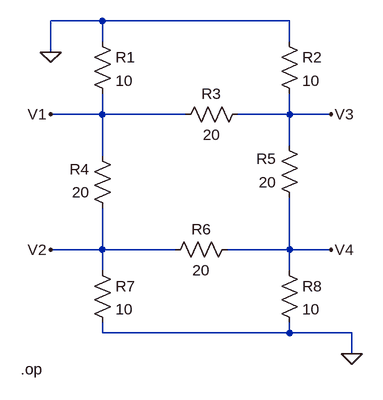
[diagram p0: schematic ejemplo2.asc]
ejemplo2.asc, the LTspice schematic file:
Version 4
SHEET 1 880 680
WIRE 128 -64 48 -64
WIRE 416 -64 128 -64
WIRE 128 -32 128 -64
WIRE 416 -32 416 -64
WIRE 48 -16 48 -64
WIRE 128 80 128 48
WIRE 128 80 48 80
WIRE 256 80 128 80
WIRE 416 80 416 48
WIRE 416 80 336 80
WIRE 480 80 416 80
WIRE 416 128 416 80
WIRE 128 144 128 80
WIRE 128 288 128 224
WIRE 128 288 48 288
WIRE 240 288 128 288
WIRE 416 288 416 208
WIRE 416 288 320 288
WIRE 480 288 416 288
WIRE 128 320 128 288
WIRE 416 320 416 288
WIRE 128 416 128 400
WIRE 416 416 416 400
WIRE 416 416 128 416
WIRE 512 416 416 416
WIRE 512 448 512 416
FLAG 48 80 V1
FLAG 48 288 V2
FLAG 480 80 V3
FLAG 480 288 V4
FLAG 48 -16 0
FLAG 512 448 0
SYMBOL res 112 -48 R0
SYMATTR InstName R1
SYMATTR Value 10
SYMBOL res 400 -48 R0
SYMATTR InstName R2
SYMATTR Value 10
SYMBOL res 352 64 R90
WINDOW 0 0 56 VBottom 2
WINDOW 3 32 56 VTop 2
SYMATTR InstName R3
SYMATTR Value 20
SYMBOL res 144 240 R180
WINDOW 0 36 76 Left 2
WINDOW 3 36 40 Left 2
SYMATTR InstName R4
SYMATTR Value 20
SYMBOL res 432 224 R180
WINDOW 0 36 76 Left 2
WINDOW 3 36 40 Left 2
SYMATTR InstName R5
SYMATTR Value 20
SYMBOL res 224 304 R270
WINDOW 0 32 56 VTop 2
WINDOW 3 0 56 VBottom 2
SYMATTR InstName R6
SYMATTR Value 20
SYMBOL res 112 304 R0
SYMATTR InstName R7
SYMATTR Value 10
SYMBOL res 400 304 R0
SYMATTR InstName R8
SYMATTR Value 10
TEXT 2 472 Left 2 !.op

The netlist it stands for:
* ejemplo2.asc
R1 0 V1 10
R2 0 V3 10
R3 V3 V1 20
R4 V2 V1 20
R5 V4 V3 20
R6 V2 V4 20
R7 V2 0 10
R8 V4 0 10
.op
.backanno
.end